# Altium schematic sheet Camera.SchDoc
size A
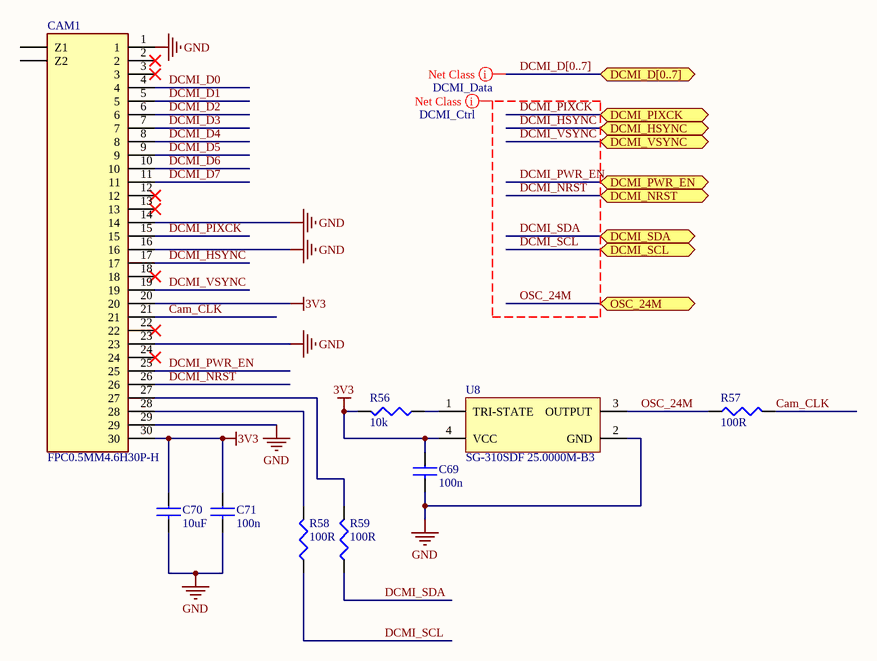
[diagram p0: Camera.SchDoc]

## Parts
C69  100n  [C0402]
C70  10uF  [C0402]
C71  100n  [C0402]
CAM1  FPC0.5MM4.6H30P-H  [FPC30P]
R56  10k  [R0402]
R57  100R  [R0402]
R58  100R  [R0402]
R59  100R  [R0402]
U8  SG-310SDF 25.0000M-B3  [EPSON-SG-310-4_V]

## Ports
DCMI_D[0..7] (bidir), DCMI_HSYNC (bidir), DCMI_NRST (bidir), DCMI_PIXCK (bidir), DCMI_PWR_EN (bidir), DCMI_SCL (bidir), DCMI_SDA (bidir), DCMI_VSYNC (bidir), OSC_24M (bidir)

## Nets
3V3: C69.1 C70.1 C71.1 CAM1.20 CAM1.30 R56.2 U8.4(VCC)
GND: C69.2 C70.2 C71.2 CAM1.1 CAM1.14 CAM1.16 CAM1.23 CAM1.29 U8.2(GND)
Cam_CLK: CAM1.21 R57.2
DCMI_D0: CAM1.4
DCMI_D1: CAM1.5
DCMI_D2: CAM1.6
DCMI_D3: CAM1.7
DCMI_D4: CAM1.8
DCMI_D5: CAM1.9
DCMI_D6: CAM1.10
DCMI_D7: CAM1.11
DCMI_HSYNC: CAM1.17 ; port DCMI_HSYNC
DCMI_NRST: CAM1.26 ; port DCMI_NRST
DCMI_PIXCK: CAM1.15 ; port DCMI_PIXCK
DCMI_PWR_EN: CAM1.25 ; port DCMI_PWR_EN
DCMI_SCL: R58.1 ; port DCMI_SCL
DCMI_SDA: R59.1 ; port DCMI_SDA
DCMI_VSYNC: CAM1.19 ; port DCMI_VSYNC
OSC_24M: R57.1 U8.3(OUTPUT) ; port OSC_24M
NetCAM1_27: CAM1.27 R59.2
NetCAM1_28: CAM1.28 R58.2
NetR56_1: R56.1 U8.1(TRI-STATE)

Not connected (* = marked no-connect by the designer): CAM1 2* 3* 12* 13* 18* 22* 24* Z1 Z2

## Buses and harness runs
bus DCMI_D[0..7] = port DCMI_D[0..7]

## Layout directives
net class DCMI_Data: (no net found under the mark)
net class DCMI_Ctrl: DCMI_HSYNC, DCMI_NRST, DCMI_PIXCK, DCMI_PWR_EN, DCMI_SCL, DCMI_SDA, DCMI_VSYNC, OSC_24M

## Library data of the parts
C69 C71 = C1005X5R1H104K: CAP CER .10UF 50V X5R 10% 0402; Manufacturer: TDK Corporation; Capacitance: 0.1µF; Value: 100nF; .Checked PCB: used; Category: Capacitors; Supplier Part Number: 445-5942-1-ND; Manufacturer Part Number: C1005X5R1H104K; Operating Temperature: -55°C ~ 85°C; Package / Case: 0402 (1005 Metric); Price 1k [$]: 0.02340; .Checked SCH: used; Voltage - Rated: 50V; Supplier: Digikey; Supplier 1: Digi-Key; Supplier Part Number 1: 445-5942-1-ND; RoHS: RoHS Compliant; Stock 1: 106926; Pricing 1: 1=0.27, 10=0.18, 100=0.072, 250=0.05176, 500=0.0369, 1000=0.027 (USD); Tolerance: ±10%; Temperature Coefficient: X5R; Mounting Type: Surface Mount, MLCC; Applications: General Purpose; Ratings: -; Size / Dimension: 0.039" L x 0.020" W (1.00mm x 0.50mm); Height - Seated (Max): -; Thickness (Max): 0.022" (0.55mm); Lead Spacing: -; Features: -; Packaging: Cut Tape (CT); Lead Style: -; ComponentLink1URL: http://www.tdk.co.jp/tefe02/e412_c.pdf; ComponentLink1Description: http://www.tdk.co.jp/tefe02/e412_c.pdf
C70 = C1005X5R1A475M: CAP CER 4.7UF 10V 20% X5R 0402; Manufacturer: TDK Corporation; Capacitance: 4.7µF; .Checked PCB: RF; Supplier 1: Digi-Key; Supplier Part Number 1: 445-8023-1-ND; Manufacturer Part Number: C1005X5R1A475M; RoHS: RoHS Compliant; Category: Capacitors; Stock 1: 10140; Pricing 1: 1=0.53, 10=0.415, 100=0.25, 250=0.18752, 500=0.16, 1000=0.125, 5000=0.095 (USD); Voltage - Rated: 10V; Tolerance: ±20%; Temperature Coefficient: X5R; Mounting Type: Surface Mount, MLCC; Operating Temperature: -55°C ~ 85°C; Applications: General Purpose; Ratings: -; Package / Case: 0402 (1005 Metric); Size / Dimension: 0.039" L x 0.020" W (1.00mm x 0.50mm); Height - Seated (Max): -; Thickness (Max): -; Lead Spacing: -; Features: -; Packaging: Cut Tape (CT); Lead Style: -; ComponentLink1URL: http://www.tdk.com/pdf/general_B11.pdf; ComponentLink1Description: http://www.tdk.com/pdf/general_B11.pdf; .Checked SCH: RF
CAM1 = FPC30: Connector; Manufacturer_Name: AVX; Manufacturer_Part_Number: 006200307032800+; Datasheet Link: https://componentsearchengine.com/Datasheets/1/006200307032800+.pdf; Height: 2.9mm; Mouser Part Number: 581-006200307032800+; Mouser Price/Stock: https://www.mouser.com/Search/Refine.aspx?Keyword=581-006200307032800%2B
R56 = RC0402FR-0710KL: RES 10.0K OHM 1/16W 1% 0402 SMD; Manufacturer: Yageo; Power (Watts): 0.063W, 1/16W; .Checked PCB: used; Temperature Coefficient: ±100ppm/°C; Category: Resistors; Supplier Part Number: 311-10.0KLRCT-ND; Manufacturer Part Number: RC0402FR-0710KL; Package / Case: 0402 (1005 Metric); Price 1k [$]: 0.01421; Resistance (Ohms): 10K; Tolerance: ±1%; Value: 10k; .Checked SCH: used; Supplier: Digikey; Supplier 1: Digi-Key; Supplier Part Number 1: 311-10.0KLRCT-ND; RoHS: RoHS Compliant; Stock 1: 2916495; Pricing 1: 10=0.014, 50=0.0104, 100=0.0079, 250=0.00584, 500=0.00432, 1000=0.00288 (USD); Composition: Thick Film; Features: -; Size / Dimension: 0.039" L x 0.020" W (1.00mm x 0.50mm); Height: 0.016" (0.40mm); Number of Terminations: 2; Packaging: Cut Tape (CT); ComponentLink1URL: http://www.yageo.com/documents/recent/PYu-RC0402_51_RoHS_L_6.pdf; ComponentLink1Description: http://www.yageo.com/documents/recent/PYu-RC0402_51_RoHS_L_6.pdf
R57-R59 = RC0402FR-07100RL: RES 100 OHM 1/16W 1% 0402 SMD; Manufacturer: Yageo; Resistance (Ohms): 100; Power (Watts): 0.063W, 1/16W; .Checked PCB: RF; Temperature Coefficient: ±100ppm/°C; Category: Resistors; Supplier Part Number: 311-100LRCT-ND; Manufacturer Part Number: RC0402FR-07100RL; Package / Case: 0402 (1005 Metric); Price 1k [$]: 0.01421; Tolerance: ±1%; Value: 100R; .Checked SCH: RF; Supplier: Digikey; Supplier 1: Digi-Key; Supplier Part Number 1: 311-100LRCT-ND; RoHS: RoHS Compliant; Stock 1: 1682040; Pricing 1: 10=0.014, 50=0.0104, 100=0.0079, 250=0.00584, 500=0.00432, 1000=0.00288 (USD); Composition: Thick Film; Features: -; Size / Dimension: 0.039" L x 0.020" W (1.00mm x 0.50mm); Height: 0.016" (0.40mm); Number of Terminations: 2; Packaging: Cut Tape (CT); ComponentLink1URL: http://www.yageo.com/documents/recent/PYu-RC0402_51_RoHS_L_6.pdf; ComponentLink1Description: http://www.yageo.com/documents/recent/PYu-RC0402_51_RoHS_L_6.pdf
U8 = CMP-1695-00002-3: Crystal Oscillator (SPXO), 2.5 V, 25 MHz, -20 to 70 degC, 4-Pin SMD, RoHS, Tape and Reel; ComponentLink2URL: http://www5.epsondevice.com/en/products/spxo_standard/sg310sdf.html#; DatasheetVersion: Rev. Feb-15; ComponentLink1Description: Manufacturer URL; ComponentLink1URL: https://www.eea.epson.com/; Mounting Technology: Surface Mount; PartNumber: SG-310SDF 25.0000M-B3; PackageDescription: 4-Pin Surface Mount Device, Body 3.2 x 2.5 mm; ComponentLink2Description: Datasheet; Max Operating Temperature: 70 degC; Length: 3.2 mm; Packaging: Tape and Reel; Height: 1.05 mm; RoHSCompliant: True; Min Operating Temperature: -20 degC; Width: 2.5 mm